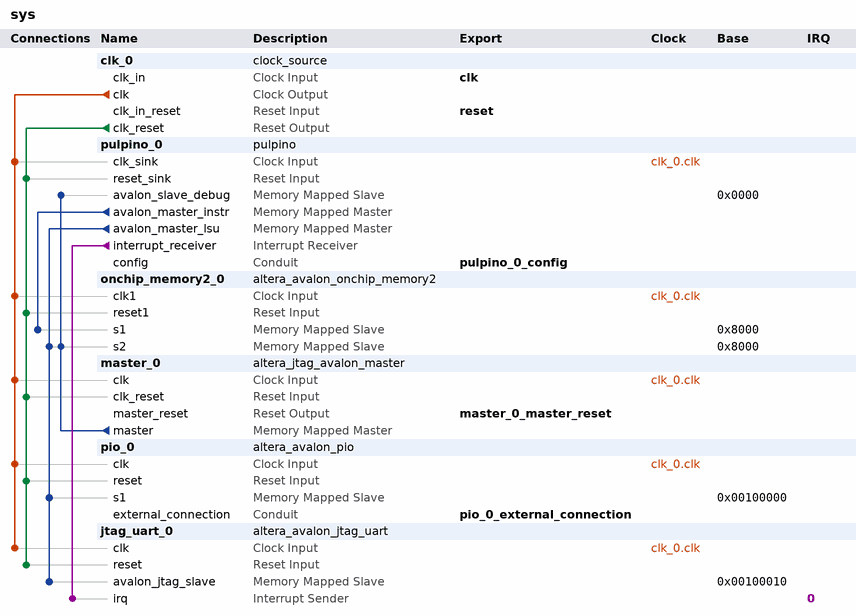
[diagram p0: system contents]
# Platform Designer (Qsys) system sys, Cyclone IV E EP4CE115F29C7
# Parameters at their usual value, and those the tool derives, are not listed.
package require -exact qsys 17.1
create_system sys
set_project_property DEVICE_FAMILY {Cyclone IV E}
set_project_property DEVICE EP4CE115F29C7

add_instance clk_0 clock_source 17.1
set_instance_parameter_value clk_0 clockFrequency 50000000

add_instance pulpino_0 pulpino 1.0
set_instance_parameter_value pulpino_0 AXI_ADDR_WIDTH 32
set_instance_parameter_value pulpino_0 AXI_DATA_WIDTH 32
set_instance_parameter_value pulpino_0 AXI_ID_MASTER_WIDTH 10
set_instance_parameter_value pulpino_0 AXI_ID_SLAVE_WIDTH 10
set_instance_parameter_value pulpino_0 AXI_USER_WIDTH 0
set_instance_parameter_value pulpino_0 RISCY_RV32F false
set_instance_parameter_value pulpino_0 USE_ZERO_RISCY true
set_instance_parameter_value pulpino_0 ZERO_RV32E false
set_instance_parameter_value pulpino_0 ZERO_RV32M true

add_instance onchip_memory2_0 altera_avalon_onchip_memory2 17.1
set_instance_parameter_value onchip_memory2_0 dataWidth 32
set_instance_parameter_value onchip_memory2_0 dualPort true
set_instance_parameter_value onchip_memory2_0 initMemContent true
set_instance_parameter_value onchip_memory2_0 memorySize 32768
set_instance_parameter_value onchip_memory2_0 singleClockOperation true

add_instance master_0 altera_jtag_avalon_master 17.1

add_instance pio_0 altera_avalon_pio 17.1
set_instance_parameter_value pio_0 direction Output
set_instance_parameter_value pio_0 width 8

add_instance jtag_uart_0 altera_avalon_jtag_uart 17.1
set_instance_parameter_value jtag_uart_0 simInteractiveOptions NO_INTERACTIVE_WINDOWS
set_instance_parameter_value jtag_uart_0 useRegistersForReadBuffer true
set_instance_parameter_value jtag_uart_0 useRegistersForWriteBuffer true

# connections
add_connection clk_0.clk jtag_uart_0.clk clock
add_connection clk_0.clk master_0.clk clock
add_connection clk_0.clk onchip_memory2_0.clk1 clock
add_connection clk_0.clk pio_0.clk clock
add_connection clk_0.clk pulpino_0.clk_sink clock
add_connection clk_0.clk_reset jtag_uart_0.reset reset
add_connection clk_0.clk_reset master_0.clk_reset reset
add_connection clk_0.clk_reset onchip_memory2_0.reset1 reset
add_connection clk_0.clk_reset pio_0.reset reset
add_connection clk_0.clk_reset pulpino_0.reset_sink reset
add_connection master_0.master onchip_memory2_0.s2 avalon
set_connection_parameter_value master_0.master/onchip_memory2_0.s2 baseAddress 0x8000
add_connection master_0.master pulpino_0.avalon_slave_debug avalon
set_connection_parameter_value master_0.master/pulpino_0.avalon_slave_debug baseAddress 0x0000
add_connection pulpino_0.avalon_master_instr onchip_memory2_0.s1 avalon
set_connection_parameter_value pulpino_0.avalon_master_instr/onchip_memory2_0.s1 baseAddress 0x8000
add_connection pulpino_0.avalon_master_lsu jtag_uart_0.avalon_jtag_slave avalon
set_connection_parameter_value pulpino_0.avalon_master_lsu/jtag_uart_0.avalon_jtag_slave baseAddress 0x00100010
add_connection pulpino_0.avalon_master_lsu onchip_memory2_0.s2 avalon
set_connection_parameter_value pulpino_0.avalon_master_lsu/onchip_memory2_0.s2 baseAddress 0x8000
add_connection pulpino_0.avalon_master_lsu pio_0.s1 avalon
set_connection_parameter_value pulpino_0.avalon_master_lsu/pio_0.s1 baseAddress 0x00100000
add_connection pulpino_0.interrupt_receiver jtag_uart_0.irq interrupt
set_connection_parameter_value pulpino_0.interrupt_receiver/jtag_uart_0.irq irqNumber 0

# exported interfaces
add_interface clk clock sink
set_interface_property clk EXPORT_OF clk_0.clk_in
add_interface master_0_master_reset reset source
set_interface_property master_0_master_reset EXPORT_OF master_0.master_reset
add_interface pio_0_external_connection conduit end
set_interface_property pio_0_external_connection EXPORT_OF pio_0.external_connection
add_interface pulpino_0_config conduit end
set_interface_property pulpino_0_config EXPORT_OF pulpino_0.config
add_interface reset reset sink
set_interface_property reset EXPORT_OF clk_0.clk_in_reset

set_interconnect_requirement {$system} qsys_mm.clockCrossingAdapter HANDSHAKE
set_interconnect_requirement {$system} qsys_mm.enableEccProtection FALSE
set_interconnect_requirement {$system} qsys_mm.insertDefaultSlave FALSE
set_interconnect_requirement {$system} qsys_mm.maxAdditionalLatency 1

save_system sys.qsys
